# EAGLE design MainBoard (EAGLE 8.7.1)
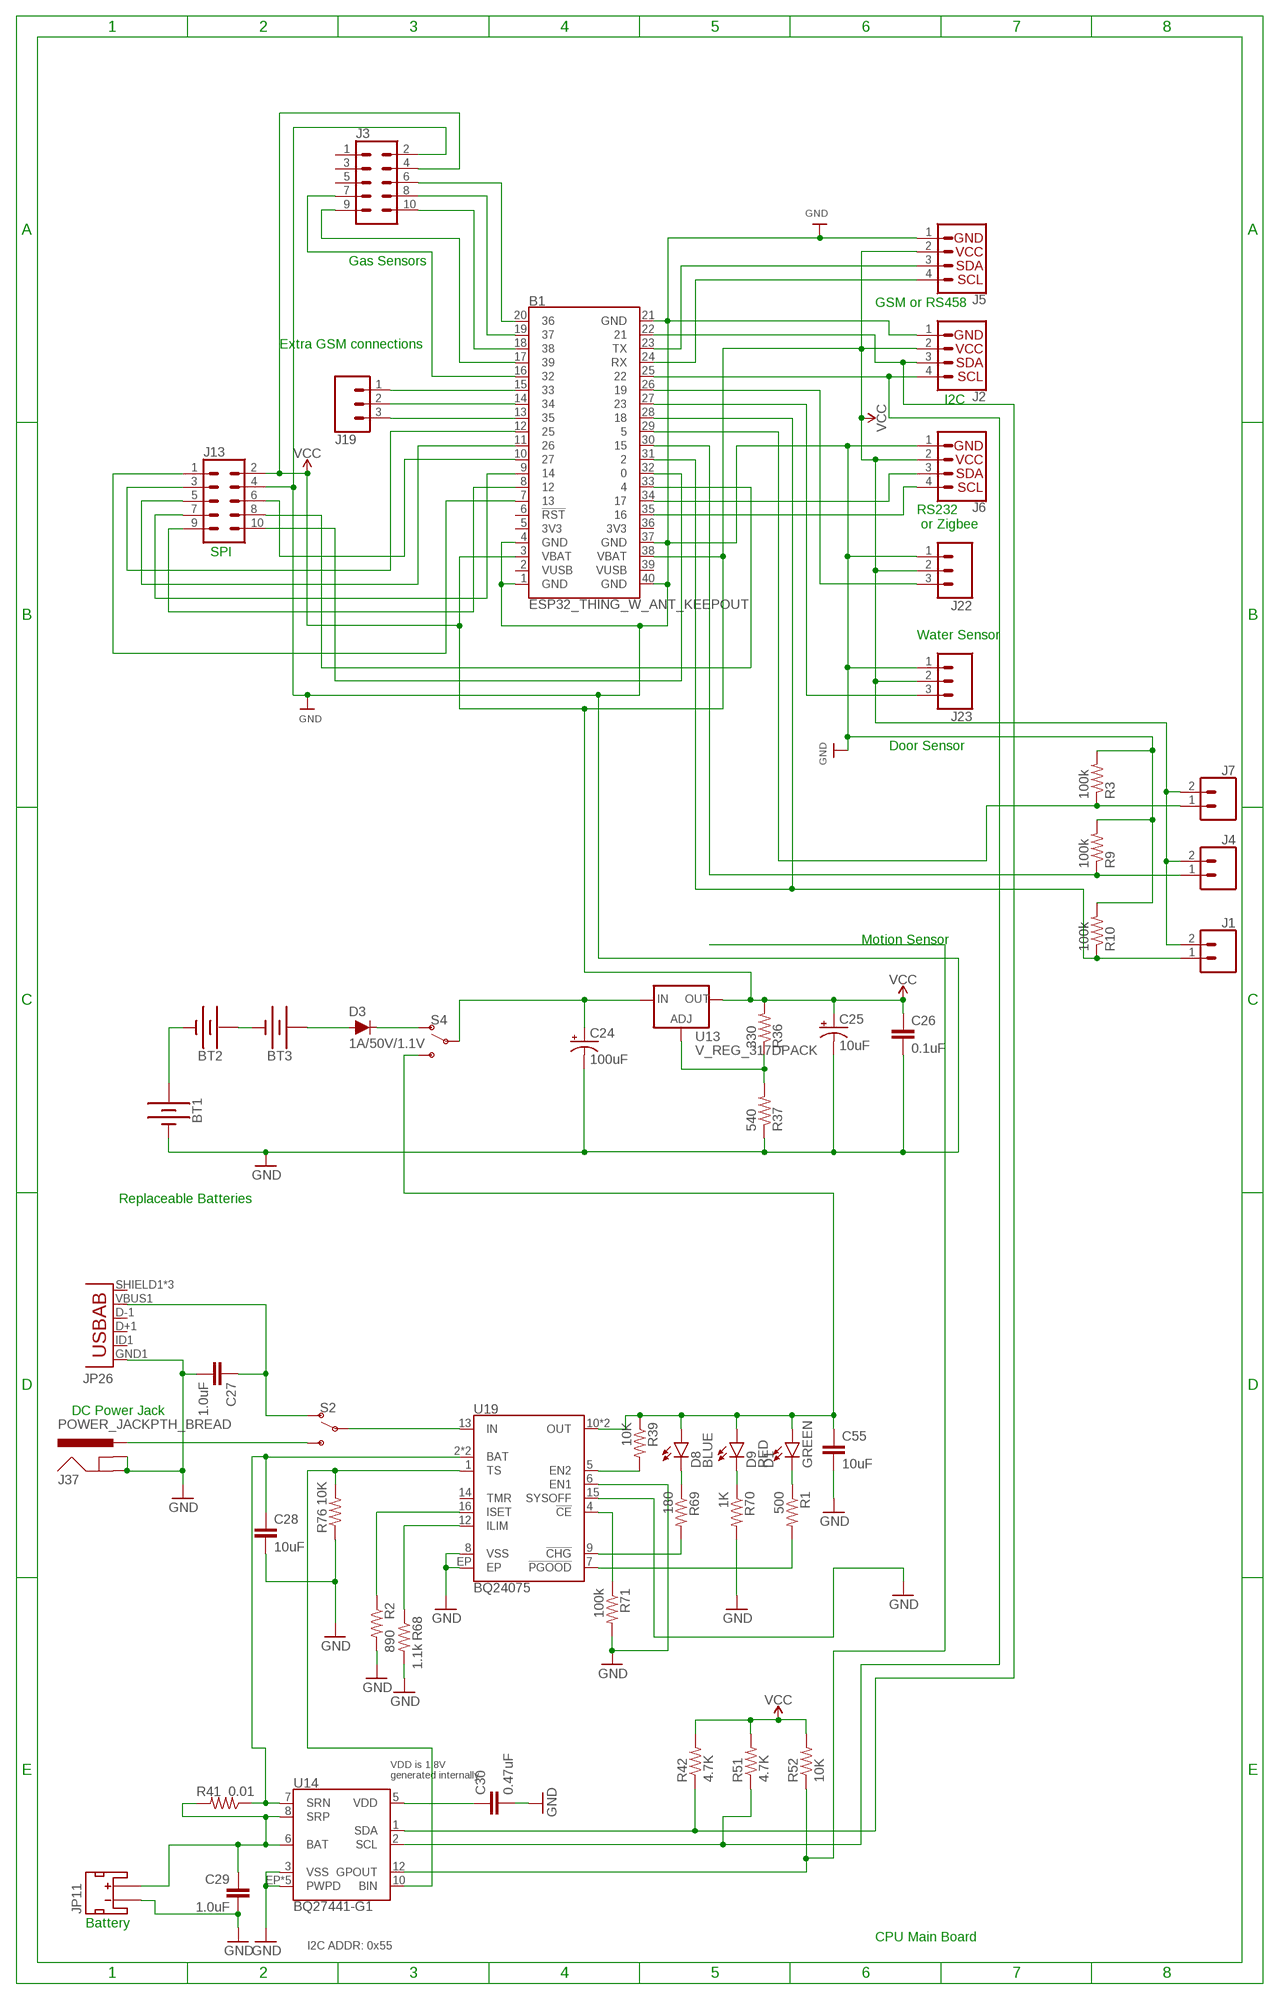
[diagram p0: schematic, sheet 1]

## Parts
B1  ESP32_THING_W_ANT_KEEPOUT  [ESP32_THING]
BT1  BATTERY-AA  [BATTERY-AA]
BT2  BATTERY-AA  [BATTERY-AA]
BT3  BATTERY-AA  [BATTERY-AA]
C24  100uF  100UF-POLAR-10X10.5-63V-20%  [NIC_10X10.5_CAP]
C25  10uF  10UF-POLAR-0603-6.3V-20%(TANT)  [0603-POLAR]
C26  0.1uF  0.1UF-0402-16V-10%  [0402]
C27  1.0uF  1.0UF50V10%(1206)  [1206-CAP]
C28  10uF  10UF10V10%(0805)  [0805-CAP]
C29  1.0uF  1.0UF-16V-10%(0603)  [0603-CAP]
C30  0.47uF  CAP0603-CAP  [0603-CAP]
C55  10uF  10UF10V10%(0805)  [0805-CAP]
D1  GREEN  LED-GREEN0603  [LED-0603@1]
D3  1A/50V/1.1V  DIODE-PTH  [DIODE-1N4001]
D8  BLUE  LED-BLUE0603  [LED-0603]
D9  RED  LED-RED0603  [LED-0603]
J1  CONN_02JST-PTH-2  [JST-2-PTH]
J2  QWIIC_CONNECTORJS-1MM  [1X04_1MM_RA@1]
J3  CONN_05X2PTH  [2X5]
J4  CONN_02JST-PTH-2  [JST-2-PTH]
J5  QWIIC_CONNECTORJS-1MM  [1X04_1MM_RA@1]
J6  QWIIC_CONNECTORJS-1MM  [1X04_1MM_RA@1]
J7  CONN_02JST-PTH-2  [JST-2-PTH]
J13  CONN_05X2PTH  [2X5]
J19  CONN_03JST-PTH  [JST-3-PTH]
J22  CONN_03JST-PTH  [JST-3-PTH]
J23  CONN_03JST-PTH  [JST-3-PTH]
J37  POWER_JACKPTH_BREAD  [POWER_JACK_PTH_BREAD]
JP11  JST_2MM_MALE  [JST-2-SMD]
JP26  USB-ABCONN-11794  [USB-AB-MICRO-SMD_V03]
R1  500  1KOHM-1/10W-1%(0603)  [0603-RES]
R2  890  RESISTOR0603-RES  [0603-RES]
R3  100k  330OHM1/10W1%(0603)  [0603-RES@1]
R9  100k  330OHM1/10W1%(0603)  [0603-RES@1]
R10  100k  330OHM1/10W1%(0603)  [0603-RES@1]
R36  330  330OHM1/10W1%(0603)  [0603-RES@1]
R37  540  330OHM1/10W1%(0603)  [0603-RES@1]
R39  10K  10KOHM-1/10W-1%(0603)0603  [0603-RES]
R41  0.01  RESISTOR1206  [1206]
R42  4.7K  4.7KOHM-1/10W-1%(0603)  [0603-RES]
R51  4.7K  4.7KOHM-1/10W-1%(0603)  [0603-RES]
R52  10K  10KOHM-1/10W-1%(0603)0603  [0603-RES]
R68  1.1k  RESISTOR0603-RES  [0603-RES]
R69  180  180OHM1/10W1%(0603)  [0603-RES]
R70  1K  1KOHM-1/10W-1%(0603)  [0603-RES]
R71  100k  100KOHM-1/10W-1%(0603)  [0603-RES]
R76  10K  10KOHM-1/10W-1%(0603)0603  [0603-RES]
S2  SWITCH-SPDT-PTH-11.6X4.0MM  [SWITCH_SPDT_PTH_11.6X4.0MM]
S4  SWITCH-SPDT-PTH-11.6X4.0MM  [SWITCH_SPDT_PTH_11.6X4.0MM]
U13  V_REG_317DPACK  [V-REG_DPACK]
U14  BQ27441-G1  [PDSO-N12]
U19  BQ24075  [PVQFN-N16]

## Nets
!CHG!1: R69.2 U19.9(!CHG!)
!PGOOD!1: R1.2 U19.7(!PGOOD!)
BATTERY_IN: C29.1 JP11.2(+) R41.2 U14.6(BAT) U14.8(SRP)
EN2: R39.2 U19.5(EN2)
GND: B1.1(GND) B1.4(GND) B1.21(GND) B1.37(GND) B1.40(GND) BT1.GND@1(-) C24.- C25.- C26.2 C27.2 C28.2 C29.2 C30.2 C55.2 J2.1 J3.2 J5.1 J6.1 J13.4 J22.1 J23.1 J37.GND J37.GNDBREAK JP11.1(-) JP26.GND1(GND) R2.2 R3.2 R9.2 R10.2 R37.1 R68.2 R70.2 R71.2 R76.1 U14.3(VSS) U14.EP1(PWPD) U14.EP2(PWPD) U14.EP3(PWPD) U14.EP4(PWPD) U14.EP(PWPD) U19.6(EN1) U19.8(VSS) U19.15(SYSOFF) U19.EP
GPOUT: R52.1 U14.12(GPOUT)
ILIM1: R68.1 U19.12(ILIM)
ISET1: R2.1 U19.16(ISET)
N$1: C30.1 U14.5(VDD)
N$2: R71.1 U19.4(!CE!)
N$3: D1.C R1.1
N$4: BT2.PWR@1(+) BT3.GND@1(-)
N$5: BT3.PWR@1(+) D3.A
N$6: D3.C S4.1(O)
N$7: B1.15 J19.1
N$8: B1.34 J6.3
N$9: B1.35 J6.4
N$10: B1.23(TX) J5.3
N$11: B1.24(RX) J5.4
N$12: B1.13 J19.3
N$13: B1.16 J3.7
N$20: B1.29 J7.1 R3.1
N$21: B1.30 J4.1 R9.1
N$23: B1.26 J22.3
N$25: B1.8 J13.9
N$26: B1.9 J13.7
N$27: B1.7 J13.1
N$28: B1.11 J13.5
N$29: B1.12 J13.3
N$30: B1.10 J13.6
N$31: B1.33 J13.8
N$34: B1.14 J19.2
N$51: B1.32 J13.10
N$57: B1.17 J3.9
N$61: B1.18 J3.10
N$62: B1.19 J3.8
N$66: B1.27 J23.3
N$70: B1.20 J3.6
N$81: B1.28 B1.31 J1.1 R10.1
N$82: J37.PWR S2.3(S)
N$84: C24.+ S4.2(P) U13.3(IN)
N$85: S2.2(P) U19.13(IN)
N$86: C27.1 JP26.VBUS1(VBUS) S2.1(O)
N$88: BT1.PWR@1(+) BT2.GND@1(-)
N$90: C28.1 R41.1 U14.7(SRN) U19.2(BAT) U19.3(BAT)
N$92: D8.C R69.1
N$94: D9.C R70.1
N$95: R36.1 R37.2 U13.1(ADJ)
OUT: C55.1 D1.A D8.A D9.A R39.1 S4.3(S) U19.10(OUT) U19.11(OUT)
SCL: B1.25 J2.4 R51.1 U14.2(SCL)
SDA: B1.22 J2.3 R42.1 U14.1(SDA)
TS: R76.2 U14.10(BIN) U19.1(TS)
VCC: B1.3(VBAT) B1.38(VBAT) C25.+ C26.1 J1.2 J2.2 J3.4 J4.2 J5.2 J6.2 J7.2 J13.2 J22.2 J23.2 R36.2 R42.2 R51.2 R52.2 U13.4(OUT)
Unconnected: B1.2(VUSB) B1.5(3V3) B1.6(!RST!) B1.36(3V3) B1.39(VUSB) J3.1 J3.3 J3.5 JP11.NC1(PAD1) JP11.NC2(PAD2) JP26.D+1(D+) JP26.D-1(D-) JP26.ID1(USBID) JP26.SHIELD1(SHIELD) JP26.SHIELD2(SHIELD) JP26.SHIELD3(SHIELD) U19.14(TMR)

## Notes on the sheet
- Gas Sensors
- GSM or RS458
- Extra GSM connections
- I2C
- RS232
   or Zigbee
- SPI
- Water Sensor
- Door Sensor
- Motion Sensor
- Replaceable Batteries
- DC Power Jack
- VDD is 1.8V
  generated internally
- Battery
- I2C ADDR: 0x55 | CPU Main Board

## Library data of the parts
B1 = SparkFun-Boards:ESP32_THING: SparkFun ESP32 Thing Board Pins, silkscreen, and logos matching the layout of the SparkFun ESP32 Thing <https://www.sparkfun.com/products/13907> Dimensions: 2.32" x 1.00"; SF_ID: DEV-13907
BT1-BT3 = SparkFun-Batteries:BATTERY: Battery - Single Cell A variety of battery chemistries, sizes, and footprints. Device List: 20MM_PTH - Coin Cell Battery Holder - 20mm (PTH) <https://www.sparkfun.com/products/783> 6.8MM_PTH - Coin Cell Battery Holder - 6.8MM(SMD) <https://www.digikey.com/product-detail/en/seiko-instruments/MS621FE-FL11E/728-1057-ND/1889208?WT.srch=1&gclid=CNOQ5a6LzdQCFZS2wAodXCkE0g> 12MM_SMD - Coin Cell Battery Holder - 12mm (SMD) <https://www.sparkfun.com/products/10592> 12MM_PTH - Coin Cell Battery Holder - 12mm (PTH) <https://www.sparkfun.com/products/7948> 20MM_SMD - 20mm Coin Cell Battery Holder (SMD) (2 legs) Used on the Big Time Watch Kit <https://www.sparkfun.com/products/11734> 20MM_SMD_4LEGS - Coin Cell Battery Holder - 20mm (SMD) <https://www.sparkfun.com/products/11892> 20MM_SMD_4LEGS_OVERPASTE - Coin Cell Battery Holder - 20mm (SMD) <https://www.sparkfun.com/products/11892> (Over-paste on the legs) 24.5MM_PTH - Coin Cell Battery Holder - 24.5mm (PTH) <https://www.sparkfun.com/products/8863> 9V - 9V Battery Holder - PC Mount Used on the SparkFun SparkPunk Sound Kit <https://www.sparkfun.com/products/11177> and SparkFun SparkPunk Sequencer Kit <https://www.sparkfun.com/products/12707> 18650 - Battery Holder - 18650 (PTH) <https://www.sparkfun.com/products/13113> AA - Battery Holder - 1xAA (PTH) <https://www.sparkfun.com/products/7949> AAA - Battery Holder - 1xAAA (PTH) <https://www.sparkfun.com/products/12718> AA_KIT - Battery Holder - 1xAA (PTH) <https://www.sparkfun.com/products/7949> Special kit package - pads only have exposed copper on one side of the board. AAA_KIT - Battery Holder - 1xAAA (PTH) <https://www.sparkfun.com/products/12718> Special kit package - pads only have exposed copper on one side of the board.; PROD_ID: BATT-08316; SF_SKU: PRT-07949
C24 = SparkFun-Capacitors:100UF-POLAR: 100µF polarized capacitors A capacitor is a passive two-terminal electrical component used to store electrical energy temporarily in an electric field.; PROD_ID: CAP-08362
C25 = SparkFun-Capacitors:10UF-POLAR: 10.0µF polarized capacitors A capacitor is a passive two-terminal electrical component used to store electrical energy temporarily in an electric field.; PROD_ID: CAP-13210
C26 = SparkFun-Capacitors:0.1UF: 0.1µF ceramic capacitors A capacitor is a passive two-terminal electrical component used to store electrical energy temporarily in an electric field.; PROD_ID: CAP-12416
C27 = SparkFun-Capacitors:1.0UF50V10%(1206): CAP-09822; PROD_ID: CAP-09822
C28 C55 = SparkFun-Capacitors:10UF10V10%(0805): CAP-11330; PROD_ID: CAP-11330
C29 = SparkFun-Capacitors:1.0UF-16V-10%(0603): CAP-00868; PROD_ID: CAP-00868
C30 = SparkFun-Capacitors:CAP: Capacitor Standard 0603 ceramic capacitor, and 0.1" leaded capacitor.; PROD_ID: CAP-13216
D1 = SparkFun-LED:LED-GREEN: Green SMD LED Used in manufacturing of various products at SparkFun Packages: 0603 - SMD 0603 package [Product Link] <http://www.futureelectronics.com/en/technologies/semiconductors/optoelectronics/leds/Pages/9894312-LTST-C190GKT.aspx?CrossPart=HSMG-C190&IM=0> LilyPad 1206 - SMD1206 LilyPad package [Product Link] <http://www.futureelectronics.com/en/Technologies/Product.aspx?ProductID=IN150NGHARVATEKCORPORATION2049943&IM=0> 1206 - SMD1206 package [Product Link] <http://www.futureelectronics.com/en/technologies/semiconductors/optoelectronics/leds/Pages/8315665-LTST-C150KGKT.aspx?IM=0> 1206 Bottom Mount -SMD 1206 Bottom Mount [Product Link] <http://www.digikey.com/product-detail/en/lite-on-inc/LTST-C230KGKT/160-1456-1-ND/386854> SparkFun Products: Pro Mini 328 -5V <https://www.sparkfun.com/products/821> RedBoard <https://www.sparkfun.com/products/12757> MP3 Trigger <https://www.sparkfun.com/products/13720> Makey Makey <https://www.sparkfun.com/products/11076>; PROD_ID: DIO-00821
D3 = SparkFun-DiscreteSemi:DIODE: Diode These are standard reverse protection diodes and small signal diodes. SparkFun Products: SparkFun SparkPunk Sound Kit <https://www.sparkfun.com/products/11177> SparkFun ESP8266 Thing <https://www.sparkfun.com/products/13231>; PROD_ID: DIO-09176
D8 = SparkFun-LED:LED-BLUE: Blue LEDs for production use Various blue LEDs stocked by SparkFun production 0603 - DIO-08575 Rebel - DIO-09553 1206 - DIO-09911; PROD_ID: DIO-08575
D9 = SparkFun-LED:LED-RED: Assorted Red LEDs LilyPad 1206- DIO-09912 1206- DIO-00809 0603- DIO-00819 "SMART" means more efficient and expensive; PROD_ID: DIO-00819
J1 J4 J7 = SparkFun-Connectors:CONN_02: Multi connection point. Often used as Generic Header-pin footprint for 0.1 inch spaced/style header connections On any of the 0.1 inch spaced packages, you can populate with these: Break Away Headers - Straight <https://www.sparkfun.com/products/116> (PRT-00116) Break Away Male Headers - Right Angle <https://www.sparkfun.com/products/553> (PRT-00553) Female Headers <https://www.sparkfun.com/products/115> (PRT-00115) Break Away Headers - Machine Pin <https://www.sparkfun.com/products/117> (PRT-00117) Break Away Female Headers - Swiss Machine Pin <https://www.sparkfun.com/products/743> (PRT-00743) For SCREWTERMINALS and SPRING TERMINALS visit here: Screw Terimnals on SparkFun.com <https://www.sparkfun.com/search/results?term=Screw+Terminals> (5mm/3.5mm/2.54mm spacing) This device is also useful as a general connection point to wire up your design to another part of your project. Our various solder wires solder well into these plated through hole pads. Hook-Up Wire - Assortment (Stranded, 22 AWG) <https://www.sparkfun.com/products/11375> (PRT-11375) Hook-Up Wire - Assortment (Solid Core, 22 AWG) <https://www.sparkfun.com/products/11367> (PRT-11367) View the entire wire category on our website here <https://www.sparkfun.com/categories/141> Special notes: Molex polarized connector foot print use with: PRT-08233 with associated crimp pins and housings. 2.54_SCREWTERM for use with PRT-10571. 3.5mm Screw Terminal footprints for PRT-08084 5mm Screw Terminal footprints for use with PRT-08432; PROD_ID: CONN-09863; SKU: PRT-09914
J2 J5 J6 = SparkFun-Connectors:QWIIC_CONNECTOR: SparkFun I2C Standard Qwiic Connector An SMD 1mm pitch JST connector makes it easy and quick (get it? Qwiic?) to connect I2C devices to each other. The Qwiic system <http://www.sparkfun.com/qwiic> enables fast and solderless connection between popular platforms and various sensors and actuators. We carry 200mm <https://www.sparkfun.com/products/14204>, 100mm <https://www.sparkfun.com/products/14205>, 50mm <https://www.sparkfun.com/products/14206>, and breadboard friendly <https://www.sparkfun.com/products/14207> Qwiic cables. We also offer 10 pcs strips <https://www.sparkfun.com/products/14323> the SMD connectors.; PROD_ID: CONN-13694
J3 J13 = SparkFun-Connectors:CONN_05X2: Multi connection point. Often used as Generic Header-pin footprint for 0.1 inch spaced/style header connections For AVR SPI programming port, see special device with nice symbol: "AVR_SPI_PROG_5x2.dev" You can populate with any combo of single row headers, but if you'd like an exact match, check these: 2x5 AVR ICSP Male Header <https://www.sparkfun.com/products/778> (PRT-00778) 2x5 Pin Shrouded Header <https://www.sparkfun.com/products/8506> (PRT-08506) On any of the 0.1 inch spaced packages, you can populate with these: Break Away Headers - Straight <https://www.sparkfun.com/products/116> (PRT-00116) Break Away Male Headers - Right Angle <https://www.sparkfun.com/products/553> (PRT-00553) Female Headers <https://www.sparkfun.com/products/115> (PRT-00115) Break Away Headers - Machine Pin <https://www.sparkfun.com/products/117> (PRT-00117) Break Away Female Headers - Swiss Machine Pin <https://www.sparkfun.com/products/743> (PRT-00743) Special note: the shrouded connector mates well with our 5x2 ribbon cables: 2x5 Pin IDC Ribbon Cable <https://www.sparkfun.com/products/8535> (PRT-08535); PROD_ID: CONN-08499; SF_ID: PRT-0778
J19 J22 J23 = SparkFun-Connectors:CONN_03: Multi connection point. Often used as Generic Header-pin footprint for 0.1 inch spaced/style header connections On any of the 0.1 inch spaced packages, you can populate with these: Break Away Headers - Straight <https://www.sparkfun.com/products/116> (PRT-00116) Break Away Male Headers - Right Angle <https://www.sparkfun.com/products/553> (PRT-00553) Female Headers <https://www.sparkfun.com/products/115> (PRT-00115) Break Away Headers - Machine Pin <https://www.sparkfun.com/products/117> (PRT-00117) Break Away Female Headers - Swiss Machine Pin <https://www.sparkfun.com/products/743> (PRT-00743) Stackable Header - 3 Pin (Female, 0.1") <https://www.sparkfun.com/products/13875> (PRT-13875) For SCREWTERMINALS and SPRING TERMINALS visit here: Screw Terimnals on SparkFun.com <https://www.sparkfun.com/search/results?term=Screw+Terminals> (5mm/3.5mm/2.54mm spacing) This device is also useful as a general connection point to wire up your design to another part of your project. Our various solder wires solder well into these plated through hole pads. Hook-Up Wire - Assortment (Stranded, 22 AWG) <https://www.sparkfun.com/products/11375> (PRT-11375) Hook-Up Wire - Assortment (Solid Core, 22 AWG) <https://www.sparkfun.com/products/11367> (PRT-11367) View the entire wire category on our website here <https://www.sparkfun.com/categories/141> Special notes: Molex polarized connector foot print use with SKU : PRT-08232 with associated crimp pins and housings.; PROD_ID: WIRE-10037; SF_ID: PRT-09915
J37 = SparkFun-Connectors:POWER_JACK: Power Jack Connector This is the standard 5.5mm barrel jack for power. The PTH is the most common, proven, reliable, footprint. The Slot footprint only works if the mill layer is transmitted to the PCB fab house so be warned. Here are the connectors we sell at SparkFun: DC Barrel Power Jack/Connector <https://www.sparkfun.com/products/119> (PRT-00119) DC Barrel Power Jack/Connector (SMD) <https://www.sparkfun.com/products/12748> (PRT-12748) DC Barrel Jack Adapter - Breadboard Compatible <https://www.sparkfun.com/products/10811> (PRT-10811) It is used on this SparkFun product (and many, many others): SparkFun RedBoard - Programmed with Arduino <https://www.sparkfun.com/products/12757> (DEV-12757) Also, if you need a mating power supply or connector, please check these out: Wall Adapter Power Supply - 9VDC 650mA <https://www.sparkfun.com/products/298> (TOL-00298) DC Barrel Jack Adapter - Male <https://www.sparkfun.com/products/10287> (PRT-10287); PROD_ID: PRT-10811
JP11 = SparkFun-Connectors:JST_2MM_MALE: JST 2MM MALE RA CONNECTOR Two pin, compact surface mount connector. Commonly used as a battery input connection point. We really like the solid locking feeling and high current rating on these small connectors. We use these all the time as battery connectors. Mates to single-cell LiPo batteries. Here is the connector we sell at SparkFun: JST Right Angle Connector - White <https://www.sparkfun.com/products/8612> (PRT-08612) Datasheet <http://www.sparkfun.com/datasheets/Prototyping/Connectors/JST-Horizontal.pdf> It was used on these SparkFun products: SparkFun MOSFET Power Controller <https://www.sparkfun.com/products/11214> (PRT-11214) SparkFun Battery Babysitter - LiPo Battery Manager <https://www.sparkfun.com/products/13777> (PRT-13777) And many, many others that required a lipo battery connection.; PROD_ID: CONN-11443; SF_ID: PRT-08612
JP26 = SparkFun-Connectors:USB-AB: This is a USB AB connector that is compatible with USB OTG. i.e. this connector can serve as a host or device; PROD_ID: CONN-11794
R1 = SparkFun-Resistors:1KOHM-1/10W-1%(0603): RES-07856; PROD_ID: RES-07856; VALUE: 1K
R2 R68 = SparkFun-Passives:RESISTOR: Resistor Basic schematic elements and footprints for 0603, 1206, and PTH resistors.; PROD_ID: RES-10447
R3 R9 R10 R37 = SparkFun-Resistors:330OHM1/10W1%(0603): RES-00818; PROD_ID: RES-00818; VALUE: 330
R36 = SparkFun-Resistors:330OHM1/10W1%(0603): RES-00818; PROD_ID: RES-00818
R39 R52 R76 = SparkFun-Resistors:10KOHM-1/10W-1%(0603): RES-00824; PROD_ID: RES-00824
R41 = SparkFun-Resistors:RESISTOR: Resistor Basic schematic elements and footprints for 0603, 1206, and PTH resistors.; PROD_ID: RES-13218
R42 R51 = SparkFun-Resistors:4.7KOHM-1/10W-1%(0603): RES-07857; PROD_ID: RES-07857
R69 = SparkFun-Resistors:180OHM1/10W1%(0603): RES-08788; PROD_ID: RES-08788
R70 = SparkFun-Resistors:1KOHM-1/10W-1%(0603): RES-07856; PROD_ID: RES-07856
R71 = SparkFun-Resistors:100KOHM-1/10W-1%(0603): RES-07828; PROD_ID: RES-07828
S2 S4 = SparkFun-Switches:SWITCH-SPDT: Single Pole, Double Throw (SPDT) Switch Single-pole, double-throw (SPDT) switch. Variant Overview SMD-AYZ0202 Surface Mount DPDT Switch <https://www.sparkfun.com/products/597> (COM-00597) Used on e.g. LilyPad Arduino USB - ATmega32U4 Board <https://www.sparkfun.com/products/12049> PTH-11.6X4.0MM SPDT Mini Power Switch <https://www.sparkfun.com/products/102> (COM-00102) Used on e.g. SparkFun Simon Says - Through-Hole Soldering Kit <https://www.sparkfun.com/products/10547> (KIT-10547) PTH-11.6X4.0MM-KIT KIT version of SPDT Mini Power Switch - Simplifies soldering by removing tStop of switch pins - only one side can be soldered. PTH-11.6X4.0MM-LOCK LOCK version of SPDT Mini Power Switch - Offset pins hold switch in place for easier soldering. SMD-RIGHT-ANGLE Surface Mount Right Angle Switch <https://www.sparkfun.com/products/10860> (COM-10860) Used on e.g. SparkFun ESP8266 Thing <https://www.sparkfun.com/products/13231>; PROD_ID: SWCH-08261; SF_SKU: COM-00102
U13 = SparkFun-IC-Power:V_REG_317: Voltage Regulator Standard LM317 adjustable voltage regulator. AOI (Adjust Output Input). Google 'LM317 Calculator' for easy to use app to get the two resistor values needed. 240/720 for 5V output. 240/390 for 3.3V output. Spark Fun Electronics SKU : COM-00527; PROD_ID: IC-09888
U14 = battery-management-temp:BQ27441-G1; PROD_ID: IC-13220
U19 = battery-management-temp:BQ24075; PROD_ID: IC-13219

## Board
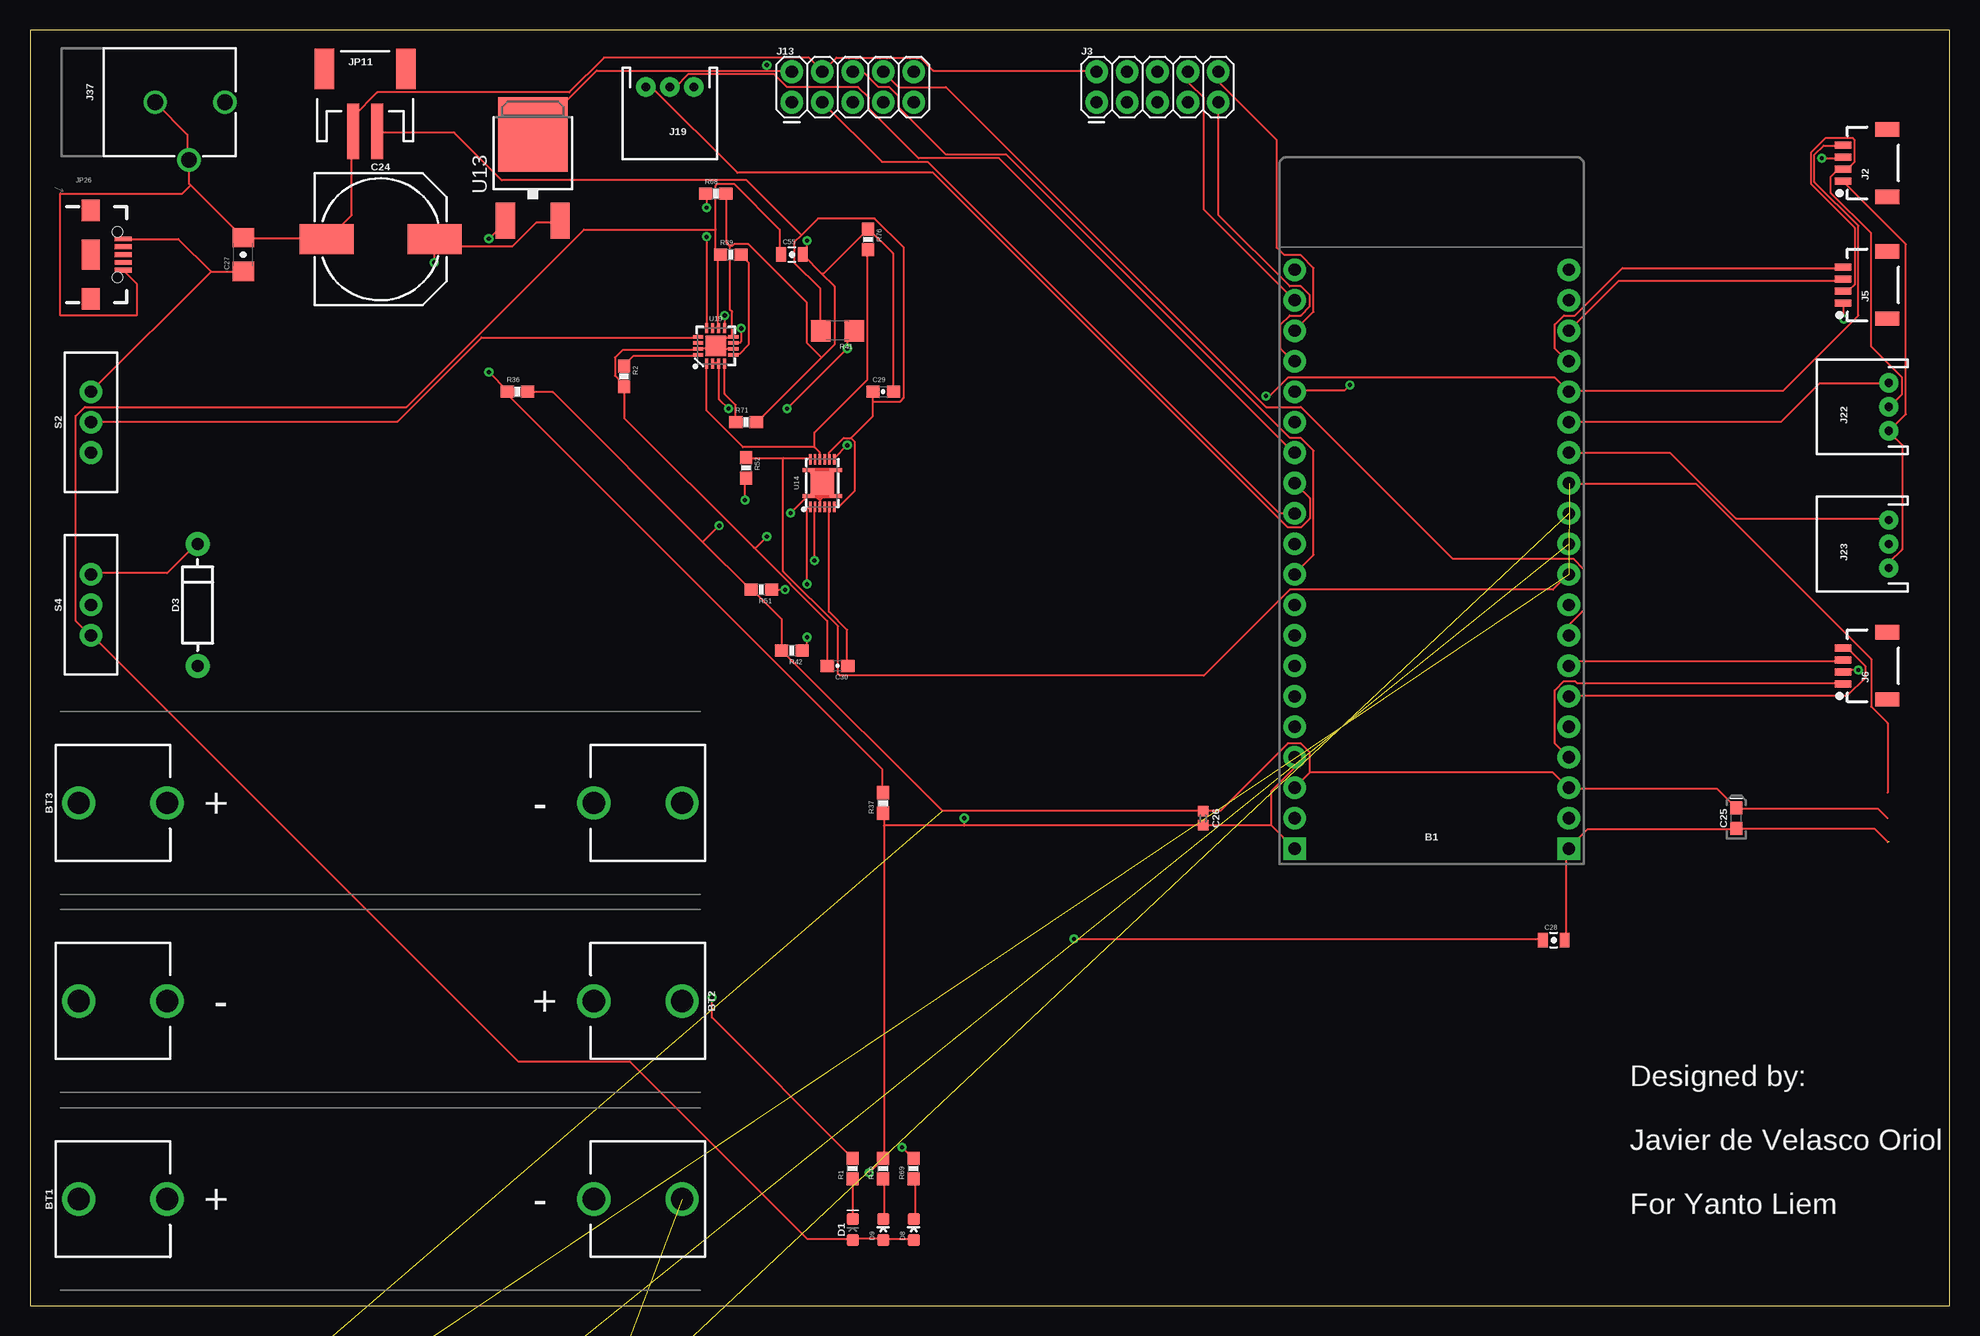
[diagram p1: board, top side]
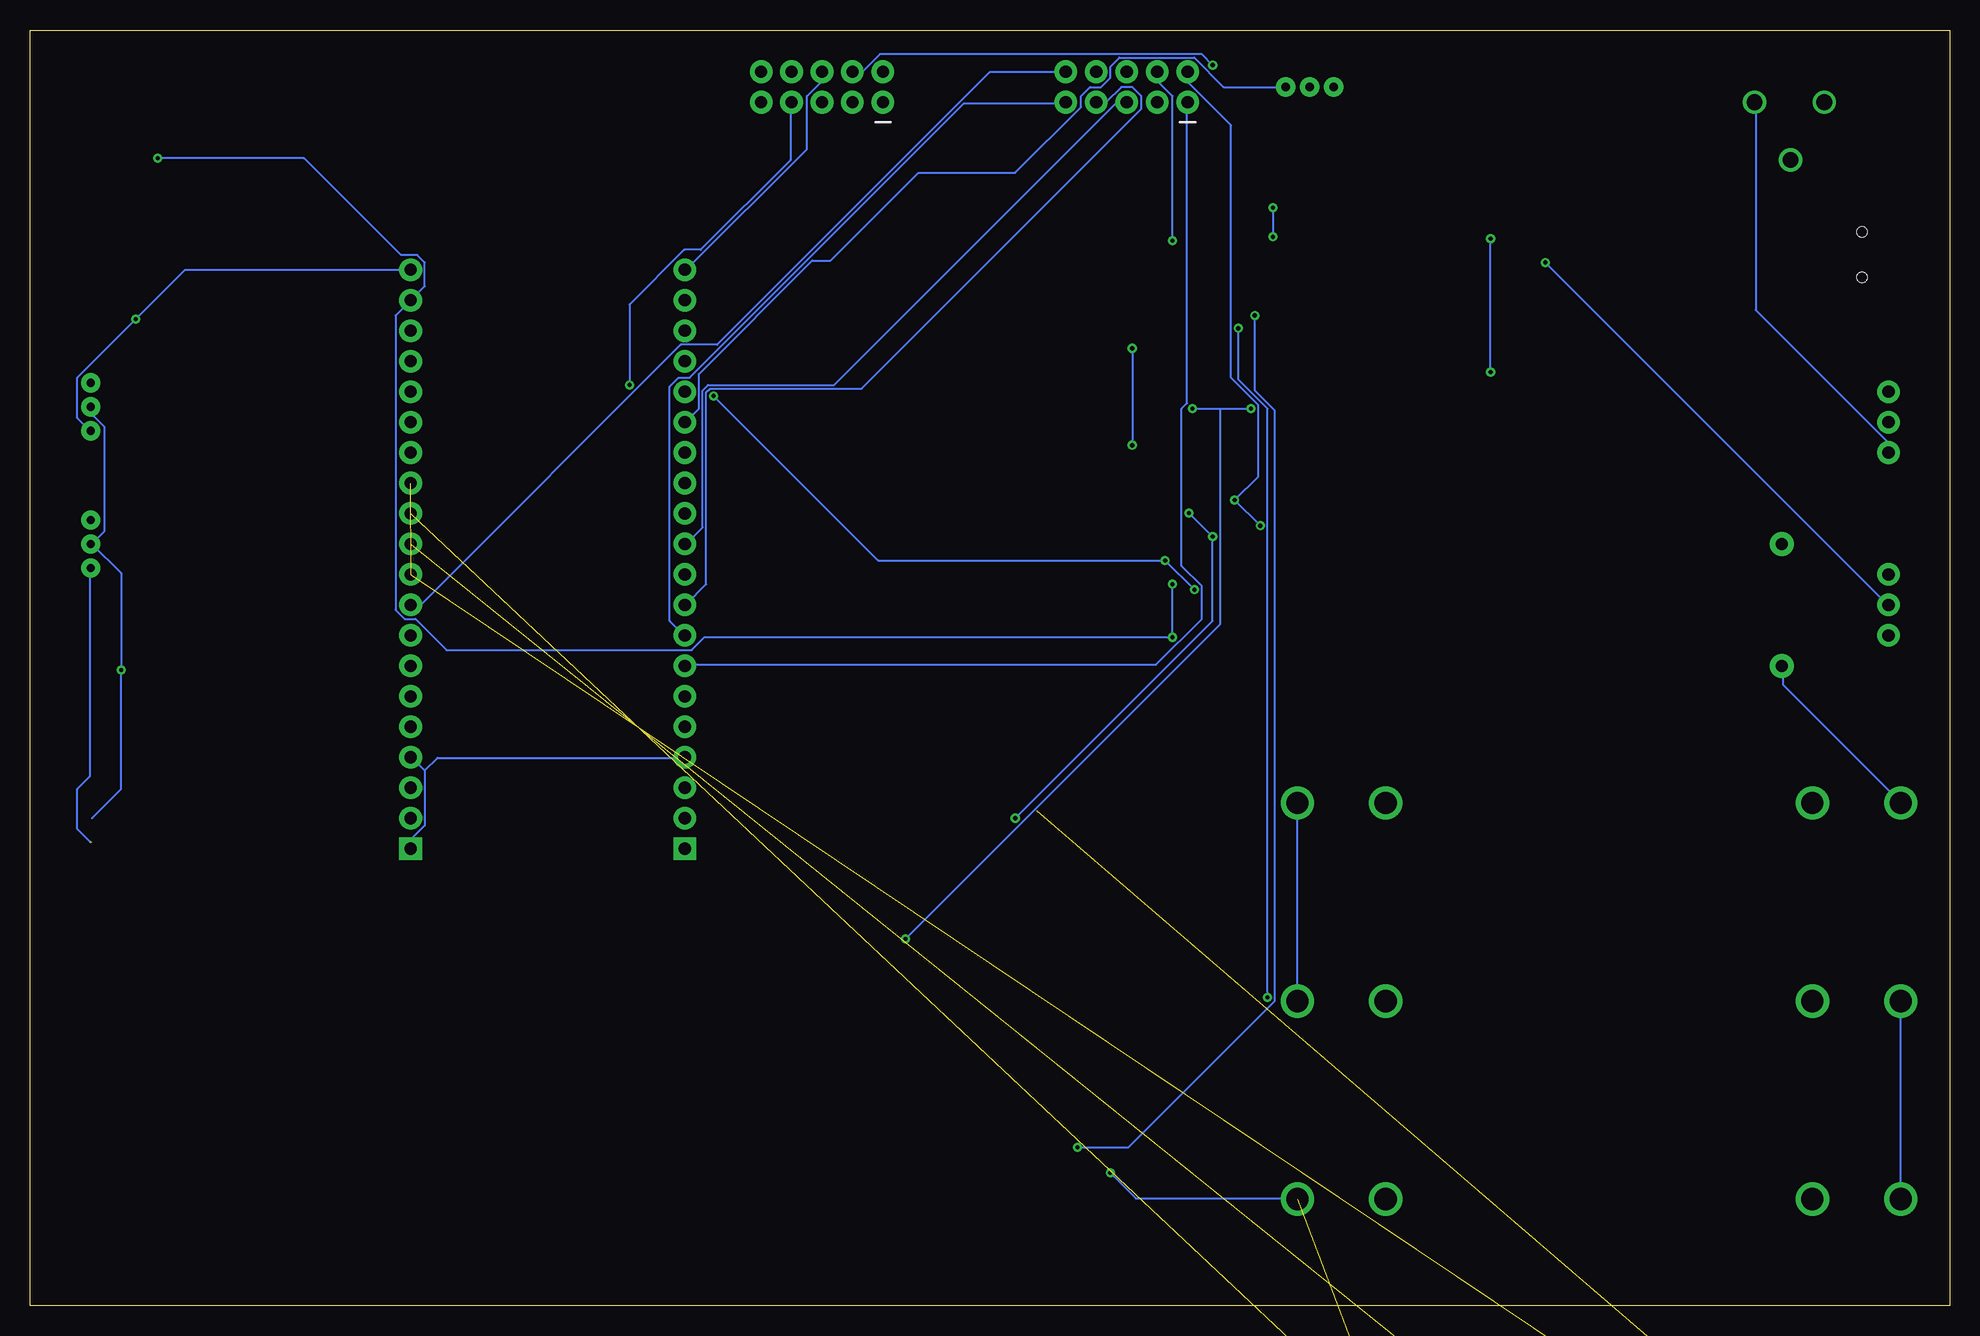
[diagram p2: board, bottom side, seen from below]

Size 160 x 106.35 mm. Coordinates in mm from the lower left corner, seen from the top.
Outline: 0,0 160,0 160,106.35 0,106.35 0,0
Copper layers (1*16): Top 0.035mm / dielectric 1.5mm / Bottom 0.035mm
Design rules "default": minimum track width 6mil, minimum drill 0.35mm, track to track 6mil, track to pad 6mil, pad to pad 6mil, via to via 6mil, smd to smd 6mil, copper to edge 40mil, drill to drill 6mil, minimum pad ring 10mil, minimum via ring 8mil, stop-mask expansion 4mil, vias tented up to drill 0mil, thermal gap 10mil

### Footprints (pad centres in the part's own frame; a part is rotated, then mirrored left to right if it is on the bottom)
ESP32_THING = drill 1.016 pad 1.88 square: 1 1.27,1.27; 40 24.13,1.27 | drill 1.016 pad 1.88: 2 1.27,3.81; 3 1.27,6.35; 4 1.27,8.89; 5 1.27,11.43; 6 1.27,13.97; 7 1.27,16.51; 8 1.27,19.05; 9 1.27,21.59; 10 1.27,24.13; 11 1.27,26.67; 12 1.27,29.21; 13 1.27,31.75; 14 1.27,34.29; 15 1.27,36.83; 16 1.27,39.37; 17 1.27,41.91; 18 1.27,44.45; 19 1.27,46.99; 20 1.27,49.53; 21 24.13,49.53; 22 24.13,46.99; 23 24.13,44.45; 24 24.13,41.91; 25 24.13,39.37; 26 24.13,36.83; 27 24.13,34.29; 28 24.13,31.75; 29 24.13,29.21; 30 24.13,26.67; 31 24.13,24.13; 32 24.13,21.59; 33 24.13,19.05; 34 24.13,16.51; 35 24.13,13.97; 36 24.13,11.43; 37 24.13,8.89; 38 24.13,6.35; 39 24.13,3.81
BATTERY-AA = drill 1.854: GND@1 25.146,0; GND@2 17.78,0; PWR@1 -25.146,0; PWR@2 -17.78,0
NIC_10X10.5_CAP = smd 4.5 x 2.5: + 4.5,0; - -4.5,0
0603-POLAR = smd 1.1 x 1: + 0.85,0; - -0.85,0
0402 = smd 0.85 x 0.9: 1 -0.58,0; 2 0.58,0
1206-CAP = smd 1.6 x 1.8: 1 -1.4,0; 2 1.4,0
0805-CAP = smd 0.8 x 1.2: 1 -0.9,0; 2 0.9,0
0603-CAP = smd 1.1 x 1: 1 -0.85,0; 2 0.85,0
LED-0603@1 = smd 1 x 1: A -0.877,0; C 0.877,0
DIODE-1N4001 = drill 1 pad 1.981: A -5.08,0; C 5.08,0
LED-0603 = smd 1 x 1: A 0,-0.877; C 0,0.877
JST-2-PTH = drill 0.7 pad 1.6: 1 -1,0; 2 1,0
1X04_1MM_RA@1 = smd 0.6 x 1.35: 1 -1.5,0; 2 -0.5,0; 3 0.5,0; 4 1.5,0 | smd 1.2 x 2: NC1 2.8,-3.675; NC2 -2.8,-3.675
2X5 = drill 1.016 pad 1.88: 1 0,0; 2 0,2.54; 3 2.54,0; 4 2.54,2.54; 5 5.08,0; 6 5.08,2.54; 7 7.62,0; 8 7.62,2.54; 9 10.16,0; 10 10.16,2.54
JST-3-PTH = drill 0.7 pad 1.6: 1 -2,0; 2 0,0; 3 2,0
POWER_JACK_PTH_BREAD = drill 1.3: GND 0,7.9; GNDBREAK 4.8,10.7; PWR 0,13.7
JST-2-SMD = smd 1 x 4.6: 1 -1,-3.7; 2 1,-3.7 | smd 1.6 x 3.4: NC1 -3.4,1.5; NC2 3.4,1.5
USB-AB-MICRO-SMD_V03 = smd 1.4 x 0.4: D+1 2.7,0; D-1 2.7,0.65; GND1 2.7,-1.3; ID1 2.7,-0.65; VBUS1 2.7,1.3 | smd 1.5 x 1.8: SHIELD1 0,3.68; SHIELD3 0,-3.68 | smd 1.5 x 2.5: SHIELD2 0,0 | hole 0.85: 2.2,1.9; 2.2,-1.9
0603-RES = smd 1.1 x 1: 1 -0.85,0; 2 0.85,0
0603-RES@1 = smd 1.1 x 1: 1 -0.85,0; 2 0.85,0
1206 = smd 1.6 x 1.8: 1 -1.4,0; 2 1.4,0
SWITCH_SPDT_PTH_11.6X4.0MM = drill 1.016 pad 1.88: 1 0,2.54; 2 0,0; 3 0,-2.54
V-REG_DPACK = smd 1.6 x 3: 1 -2.28,-4.8; 3 2.28,-4.8 | smd 5.8 x 6.2: 4 0,2.38
PDSO-N12 = smd 0.2 x 0.85: 1 -1,-1.975; 2 -0.6,-1.975; 3 -0.2,-1.975; 4 0.2,-1.975; 5 0.6,-1.975; 6 1,-1.975; 7 1,1.975; 8 0.6,1.975; 9 0.2,1.975; 10 -0.2,1.975; 11 -0.6,1.975; 12 -1,1.975 | smd 1.95 x 1.95: EP 0,0 | smd 1 x 0.25: EP1 -1.15,1.1; EP2 -1.15,-1.1; EP3 1.15,-1.1; EP4 1.15,1.1
PVQFN-N16 = smd 0.28 x 0.85: 1 -0.75,-1.475; 2 -0.25,-1.475; 3 0.25,-1.475; 4 0.75,-1.475; 9 0.75,1.475; 10 0.25,1.475; 11 -0.25,1.475; 12 -0.75,1.475 | smd 0.85 x 0.28: 5 1.475,-0.75; 6 1.475,-0.25; 7 1.475,0.25; 8 1.475,0.75; 13 -1.475,0.75; 14 -1.475,0.25; 15 -1.475,-0.25; 16 -1.475,-0.75 | smd 1.7 x 1.7: EP 0,0

### Placement (x,y rotation side)
B1  104.14,36.83 0 top
BT1  29.21,8.89 0 top
BT2  29.21,25.4 180 top
BT3  29.21,41.91 0 top
C24  29.21,88.9 0 top
C25  142.24,40.64 90 top
C26  97.79,40.64 270 top
C27  17.78,87.63 90 top
C28  127,30.48 0 top
C29  71.12,76.2 0 top
C30  67.31,53.34 180 top
C55  63.5,87.63 0 top
D1  68.58,6.35 90 top
D3  13.97,58.42 90 top
D8  73.66,6.35 0 top
D9  71.12,6.35 0 top
J1  -12.7,-34.29 0 top  (outside the outline)
J2  151.13,95.25 90 top
J3  88.9,100.33 0 top
J4  -12.7,-50.8 0 top  (outside the outline)
J5  151.13,85.09 90 top
J6  151.13,53.34 90 top
J7  -12.7,-67.31 0 top  (outside the outline)
J13  63.5,100.33 0 top
J19  53.34,101.6 180 top
J22  154.94,74.93 90 top
J23  154.94,63.5 90 top
J37  2.54,100.33 270 top
JP11  27.94,101.6 0 top
JP26  5.08,87.63 0 top
R1  68.58,11.43 90 top
R2  49.53,77.47 270 top
R3  -19.05,-190.5 0 top  (outside the outline)
R9  -19.05,-182.88 0 top  (outside the outline)
R10  -19.05,-186.69 0 top  (outside the outline)
R36  40.64,76.2 0 top
R37  71.12,41.91 90 top
R39  58.42,87.63 0 top
R41  67.31,81.28 180 top
R42  63.5,54.61 180 top
R51  60.96,59.69 180 top
R52  59.69,69.85 270 top
R68  57.15,92.71 0 top
R69  73.66,11.43 90 top
R70  71.12,11.43 90 top
R71  59.69,73.66 0 top
R76  69.85,88.9 270 top
S2  5.08,73.66 0 top
S4  5.08,58.42 0 top
U13  41.91,95.25 0 top
U14  66.04,68.58 0 top
U19  57.15,80.01 0 top

### Tracks (layer width: path | path; a pad name or v marks a point on that pad's centre or on a via)
!CHG!1  (via drill 0.35)
  Top 0.152: v57.91,82.55 57.91,81.64 U19.9 | v72.69,13.21 73.61,12.29 R69.2
  Bottom 0.152: v57.91,82.55 57.91,76.3 56.24,74.62 56.24,25.4 68.43,13.21 v72.69,13.21
!PGOOD!1  (via drill 0.35)
  Top 0.152: v59.28,81.48 59.28,80.42 59.13,80.26 58.67,80.26 U19.7 | v56.84,25.7 56.84,24.03 68.58,12.29 R1.2
  Bottom 0.152: v59.28,81.48 59.28,77.22 56.84,74.78 v56.84,25.7
BATTERY_IN
  Top 0.152: 68.43,72.34 68.73,72.03 68.73,67.92 67.51,66.7 67.06,66.7 U14.6 | 68.43,72.34 67.82,72.34 66.6,71.12 66.6,70.66 U14.8 | 70.26,75.39 70.26,74.17 68.43,72.34 | 70.26,75.39 70.26,76.15 C29.1 | 64.31,89.26 65.68,90.63 70.41,90.63 72.85,88.19 72.85,75.69 72.54,75.39 70.26,75.39 | 64.31,89.26 63.7,88.65 63.7,86.97 65.84,84.84 65.84,81.33 R41.2 | 64.31,89.26 59.74,93.83 39.32,93.83 35.36,97.79 28.96,97.79 JP11.2
EN2
  Top 0.152: U19.5 58.67,79.35 59.13,79.35 59.89,80.11 59.89,86.97 59.28,87.58 R39.2
GND  (via drill 0.35)  (4 unrouted)
  Top 0.152: 65.84,67.16 65.84,66.7 U14.3 | 65.84,67.16 65.53,67.46 64.92,67.46 U14.EP2 64.77,67.46 v63.4,66.09 | 66.14,67.46 67.06,67.46 U14.EP3 | 65.84,67.16 66.14,67.46 | U14.EP1 64.92,69.6 65.99,68.53 U14.EP | U14.EP 67.06,69.6 U14.EP4 | 66.14,67.46 66.14,68.53 U14.EP | 57,79.81 55.78,79.81 U19.15 55.63,79.65 49.38,79.65 48.77,79.04 48.77,77.52 49.53,76.76 R2.2 49.53,74.02 60.35,63.2 | 57,79.81 57.15,79.96 U19.EP | 57,79.81 57.91,79.81 | 57.91,79.81 58.52,79.81 U19.6 | 57,79.81 U19.EP | 57.91,79.81 57.91,80.57 58.06,80.72 58.52,80.72 U19.8 58.52,80.87 58.52,82.85 58.37,83.01 58.37,88.34 | 57.91,79.81 U19.EP | 60.35,63.2 66.45,57.1 66.45,53.44 C30.2 | 58.37,88.34 58.06,88.65 58.06,92.61 R68.2 | v61.42,64.11 60.5,63.2 60.35,63.2 | J37.GND 10.52,100.23 13.11,97.64 13.11,95.66 J37.GNDBREAK 13.26,95.5 13.26,93.52 13.39,93.4 | 13.39,93.4 17.68,89.1 C27.2 17.83,88.95 24.69,88.95 C24.- 24.84,88.95 26.82,90.93 26.82,97.79 JP11.1 26.98,97.94 26.98,99.16 28.96,101.14 44.96,101.14 47.85,104.04 64.92,104.04 65.99,102.97 J13.4 67.21,104.04 74.22,104.04 75.29,102.97 88.85,102.97 J3.2 | 65.99,79.04 67.06,80.11 67.06,84.99 65.99,86.05 | 65.99,79.04 60.66,73.71 R71.2 | 65.99,86.05 64.47,87.58 C55.2 64.47,87.73 64.77,88.04 v64.77,88.8 | 65.99,86.05 66.14,86.05 69.8,89.71 R76.1 69.95,89.71 71.93,87.73 71.93,76.3 C29.2 | 58.37,88.34 58.52,88.34 58.67,88.49 59.89,88.49 64.77,83.62 64.77,80.26 65.99,79.04 | v151.18,82.24 151.18,83.46 J5.1 | J2.1 151.18,93.67 156.36,88.49 156.36,74.32 154.99,72.95 J22.1 154.99,72.8 156.06,71.73 156.06,63.04 154.99,61.98 154.99,61.52 J23.1 | 71.17,40.03 71.17,40.95 R37.1
  Top 0.152: 71.17,40.03 71.17,12.29 R70.2 71.02,12.14 v69.95,11.07 | 103.48,40.03 97.84,40.03 C26.2 97.69,40.03 77.88,40.03 | B1.1 103.48,40.03 | 103.48,40.03 103.48,42.93 105.31,44.76 105.31,45.67 B1.4 | 154.84,38.66 153.77,39.73 142.34,39.73 C25.- 142.19,39.73 129.84,39.73 128.32,38.2 B1.40 128.17,38.05 128.02,37.9 128.02,30.58 C28.2 | B1.37 127.1,46.89 127.1,51.31 127.86,52.07 128.78,52.07 128.93,51.92 151.03,51.92 J6.1 | 77.88,40.03 71.17,40.03 | 77.88,40.03 v77.88,40.64 | JP26.GND1 8.89,85.22 8.89,82.55 2.54,82.55 2.54,92.71 12.7,92.71 13.39,93.4
  Bottom 0.152: v63.4,66.09 v61.42,64.11 61.42,57.1 v77.88,40.64 | v64.77,88.8 64.77,100.84 65.99,102.06 65.99,102.82 J13.4 | J22.1 154.99,72.95 156.06,74.02 156.06,77.37 v151.18,82.24 147.07,86.36 B1.21 | v69.95,11.07 67.82,8.94 54.41,8.94 BT1.GND@1 | 127.1,44.6 127.1,40.03 128.17,38.96 128.17,38.2 B1.40 | 127.1,44.6 128.17,45.67 B1.37 | 127.1,44.6 126.03,45.67 105.46,45.67 B1.4 | 154.99,38.66 156.06,39.73 156.06,43.08 154.99,44.15 154.99,61.37 J23.1
GPOUT
  Top 0.152: 62.79,70.66 59.74,70.66 R52.1 | 62.79,70.66 65.08,70.66 U14.12 | 62.79,70.66 62.79,61.21 67.36,56.64 67.36,52.68 67.51,52.53 97.84,52.53 105,59.69 126.95,59.69 128.17,60.91
ILIM1  (via drill 0.35)
  Top 0.152: v56.39,89.1 56.39,81.64 U19.12 | v56.39,91.54 56.39,92.61 R68.1
  Bottom 0.152: v56.39,91.54 v56.39,89.1
ISET1
  Top 0.152: U19.16 55.63,79.2 50.29,79.2 49.53,78.43 R2.1
N$1
  Top 0.152: U14.5 66.6,66.55 66.6,57.86 68.12,56.34 68.12,53.44 C30.1
N$2
  Top 0.152: U19.4 57.91,78.43 57.91,76 58.83,75.08 58.83,73.71 R71.1
N$3
  Top 0.152: R1.1 D1.C
N$4
  Bottom 0.152: BT2.PWR@1 54.41,25.4 54.41,41.86 BT3.GND@1
N$5
  Bottom 0.152: D3.A 13.87,53.29 13.87,51.77 4.12,42.01 BT3.PWR@1
N$6
  Top 0.152: S4.1 5.18,61.06 11.43,61.06 13.87,63.5 D3.C
N$7
  Bottom 0.152: J19.1 60.5,101.6 62.94,104.04 69.19,104.04 69.95,103.28 69.95,102.36 70.71,101.6 71.63,101.6 72.39,100.84 72.39,99.92 77.88,94.44 85.95,94.44 93.27,87.12 94.79,87.12 104.24,77.67 104.24,74.78 105.31,73.71 B1.15
N$8
  Top 0.152: J6.3 151.03,53.75 128.63,53.75 128.32,53.44 B1.34
N$9
  Top 0.152: J6.4 151.18,54.81 151.49,54.81 153.01,53.29 153.01,52.38 151.49,50.85 128.32,50.85 B1.35
N$10
  Top 0.152: B1.23 132.44,85.45 151.03,85.45 J5.3
N$11
  Top 0.152: J5.4 151.03,86.51 132.74,86.51 128.78,82.55 127.86,82.55 127.1,81.79 127.1,79.81 128.17,78.74 B1.24
N$12
  Top 0.152: J19.3 51.82,101.6 58.98,94.44 75.29,94.44 104.85,64.87 105.92,64.87 106.68,65.63 106.68,67.31 B1.13
N$13  (via drill 0.35)
  Top 0.152: v110.03,76.76 109.58,76.3 105.46,76.3 B1.16
  Bottom 0.152: v110.03,76.76 110.03,83.46 105.46,88.04 104.09,88.04 96.62,95.5 96.62,100.23 J3.7
N$20  (2 unrouted)
N$21  (2 unrouted)
N$23
  Top 0.152: J22.3 154.84,76.91 149.2,76.91 146,73.71 128.32,73.71 B1.26
N$25
  Bottom 0.152: J13.9 73.76,100.23 82.14,100.23 105,77.37 105.92,77.37 106.68,76.61 106.68,57.1 105.46,55.88 B1.8
N$26
  Bottom 0.152: J13.7 71.02,100.38 70.26,100.38 69.04,101.6 68.12,101.6 67.36,100.84 67.36,99.77 90.68,76.45 103.33,76.45 103.63,76.15 103.63,60.15 105.31,58.47 B1.9
N$27
  Bottom 0.152: J13.1 63.55,100.23 63.55,75.23 64.01,74.78 64.01,61.67 62.33,60 62.33,57.25 66.14,53.44 105.31,53.44 B1.7
N$28
  Bottom 0.152: J13.5 68.58,100.23 69.49,100.23 92.96,76.76 103.48,76.76 103.94,76.3 103.94,64.87 105.31,63.5 B1.11
N$29
  Top 0.152: J13.3 71.02,95.35 74.83,95.35 104.09,66.09 105.31,66.09 B1.12
N$30
  Top 0.152: J13.6 68.58,102.82 69.49,102.82 70.71,101.6 71.63,101.6 72.39,100.84 72.39,99.92 76.35,95.96 81.38,95.96 105,72.34 105.92,72.34 106.98,71.27 106.98,62.59 105.46,61.06 B1.10
N$31
  Top 0.152: J13.8 72.39,101.6 76.35,101.6 103.02,74.93 105.92,74.93 118.57,62.28 128.63,62.28 129.54,61.37 129.54,58.01 128.32,56.79 128.32,55.88 B1.33
N$34
  Top 0.152: J19.2 53.8,101.6 54.86,102.67 62.03,102.67 63.09,101.6 69.04,101.6 69.95,100.69 69.95,99.77 74.07,95.66 80.77,95.66 105.31,71.12 B1.14
N$51
  Bottom 0.152: B1.32 128.17,58.47 127.41,58.47 105.77,80.11 102.72,80.11 80.01,102.82 73.76,102.82 J13.10
N$57
  Top 0.152: J3.9 99.06,90.93 105,84.99 105.92,84.99 106.68,84.23 106.68,83.31 105.92,82.55 105,82.55 104.24,81.79 104.24,79.81 105.31,78.74 B1.17
N$61
  Top 0.152: J3.10 99.06,102.06 103.94,97.18 103.94,88.19 104.55,87.58 105.92,87.58 106.98,86.51 106.98,82.85 B1.18
N$62
  Top 0.152: B1.19 97.84,91.39 97.84,100.69 96.62,101.91 96.62,102.82 J3.8
N$66
  Top 0.152: B1.27 136.7,71.12 142.19,65.63 154.84,65.63 J23.3
N$70
  Bottom 0.152: J3.6 94.03,102.82 94.03,102.06 95.25,100.84 95.25,96.42 105.31,86.36 B1.20
N$81  (3 unrouted)
  Top 0.152: 154.84,42.77 154.84,48.57 153.47,49.94 153.47,53.9 138.84,68.53 128.32,68.53 B1.28
N$82
  Bottom 0.152: S2.3 5.18,71.12 5.18,72.03 16.15,83.01 16.15,100.23 J37.PWR
N$84  (via drill 0.35)
  Top 0.152: 34.29,88.34 40.23,88.34 42.22,90.32 44.04,90.32 U13.3 | 34.29,88.34 33.83,88.8 C24.+ 34.29,88.34 | v33.68,86.97 33.68,87.73 34.29,88.34
  Bottom 0.152: v33.68,86.97 5.18,58.47 S4.2
N$85
  Top 0.152: U19.13 55.63,80.72 37.64,80.72 30.63,73.71 5.18,73.71 S2.2
N$86
  Top 0.152: 15.09,86.21 17.68,86.21 C27.1 | S2.1 15.09,86.21 | JP26.VBUS1 12.37,88.93 15.09,86.21
N$88
  Bottom 0.152: BT1.PWR@1 4.12,8.94 4.12,25.4 BT2.GND@1
N$90  (via drill 0.35)
  Top 0.152: U19.2 57,78.59 57.3,78.59 U19.3 57.45,78.43 57.45,75.54 v58.22,74.78 | v68.12,71.73 67.06,70.66 U14.7 | R41.1 68.58,81.18 68.12,80.72 v68.12,79.81 v63.09,74.78 | v87.02,30.58 126.03,30.58 C28.1
  Bottom 0.152: v68.12,79.81 v68.12,71.73 | v63.09,74.78 60.81,74.78 | 60.81,74.78 v58.22,74.78 | v87.02,30.58 60.81,56.79 60.81,74.78
N$92
  Top 0.152: D8.C 73.76,7.26 73.76,10.46 R69.1
N$94
  Top 0.152: D9.C 71.17,7.26 71.17,10.46 R70.1
N$95  (via drill 0.35)
  Top 0.152: R37.2 71.02,42.77 71.02,44.76 39.93,75.84 39.93,76.15 R36.1 39.78,76.3 v38.25,77.83 | v38.25,88.95 39.62,90.32 U13.1
  Bottom 0.152: v38.25,77.83 v38.25,88.95
OUT
  Top 0.152: D8.A 73.61,5.59 71.17,5.59 D9.A 71.02,5.59 68.58,5.59 | U19.11 57,81.48 57.3,81.48 U19.10 57.3,81.64 57.3,87.43 57.45,87.58 R39.1 57.45,87.73 57.15,88.04 57.15,89.71 | 57.15,89.71 57.15,93.37 57.3,93.52 58.67,93.52 62.48,89.71 62.48,87.73 C55.1 | 68.58,5.59 64.77,5.59 49.99,20.37 40.69,20.37 5.18,55.88 S4.3 5.03,55.88 3.81,57.1 3.81,74.17 4.57,74.93 31.39,74.93 46.18,89.71 57.15,89.71 | 68.58,5.59 D1.A
SCL  (via drill 0.35)
  Top 0.152: v65.38,62.13 65.38,66.55 U14.2 | R51.1 v62.94,59.69 | J2.4 151.03,96.72 149.5,96.72 148.74,95.96 148.74,93.67 152.4,90.02 152.4,82.55 146.15,76.3 128.32,76.3 B1.25 127.1,77.37 104.85,77.37 103.33,75.84 v103.02,75.84
  Bottom 0.152: v62.94,59.69 v65.38,62.13 89.31,62.13 v103.02,75.84
SDA  (via drill 0.35)
  Top 0.152: v64.77,60.15 64.77,66.4 65.08,66.7 U14.1 | v64.77,55.73 64.77,54.97 64.47,54.66 R42.1 | v149.35,95.66 151.03,95.66 J2.3
  Bottom 0.152: v64.77,60.15 v64.77,55.73 103.78,55.73 104.85,54.66 125.27,54.66 127.86,57.25 128.78,57.25 129.54,58.01 129.54,82.55 B1.22 127.1,84.99 127.1,86.97 127.71,87.58 129.08,87.58 137.16,95.66 v149.35,95.66
TS
  Top 0.152: 65.38,71.58 59.44,71.58 56.39,74.62 56.39,78.43 U19.1 | 65.38,71.58 65.84,71.12 65.84,70.66 U14.10 | 65.38,71.58 65.38,72.8 69.8,77.22 69.8,88.04 R76.2
VCC  (via drill 0.35)  (4 unrouted)
  Top 0.152: 61.42,102.97 47.24,102.97 U13.4 | 61.42,102.97 63.4,102.97 J13.2 | 56.08,63.65 60.05,59.69 R51.2 60.2,59.69 62.64,57.25 62.64,54.66 R42.2 62.79,54.51 76.05,41.25 97.69,41.25 C26.1 97.84,41.25 99.21,41.25 104.85,46.89 105.92,46.89 106.68,46.13 106.68,44.45 | 56.08,63.65 43.59,76.15 41.6,76.15 R36.2 | v59.59,67.16 59.59,68.99 R52.2 | 56.08,63.65 v57.45,65.02 | J5.2 151.18,84.68 151.64,84.68 152.09,85.14 152.09,89.86 148.44,93.52 148.44,96.11 149.66,97.33 151.94,97.33 152.09,97.18 152.09,95.35 151.64,94.89 151.18,94.89 J2.2 151.03,94.74 150.72,94.74 150.11,94.13 150.11,92.76 153.47,89.41 153.47,79.96 156.06,77.37 156.06,76 154.99,74.93 J22.2 | v152.4,52.98 151.18,52.98 J6.2 | B1.3 106.68,44.45 | 154.84,40.64 154.08,41.4 142.34,41.4 C25.+ 142.19,41.55 140.66,43.08 128.32,43.08 B1.38 128.17,43.23 126.95,44.45 106.68,44.45 | 61.42,102.97 v61.42,103.43
  Bottom 0.152: v57.45,65.02 v59.59,67.16 57.61,69.14 57.61,75.08 59.89,77.37 59.89,98.4 63.4,101.91 63.4,102.82 J13.2 | 154.84,63.5 152.4,61.06 v152.4,52.98 152.4,43.08 154.84,40.64 | 154.84,63.5 153.77,64.57 153.77,73.25 154.84,74.32 154.84,74.93 J22.2 | 154.84,63.5 J23.2 | v61.42,103.43 62.33,104.34 89.15,104.34 90.53,102.97 91.44,102.97 J3.4

### Text on the board
tNames: Designed by: / / Javier de Velasco Oriol / / For Yanto Liem